# EAGLE design merch-hat (EAGLE 8.0.1)
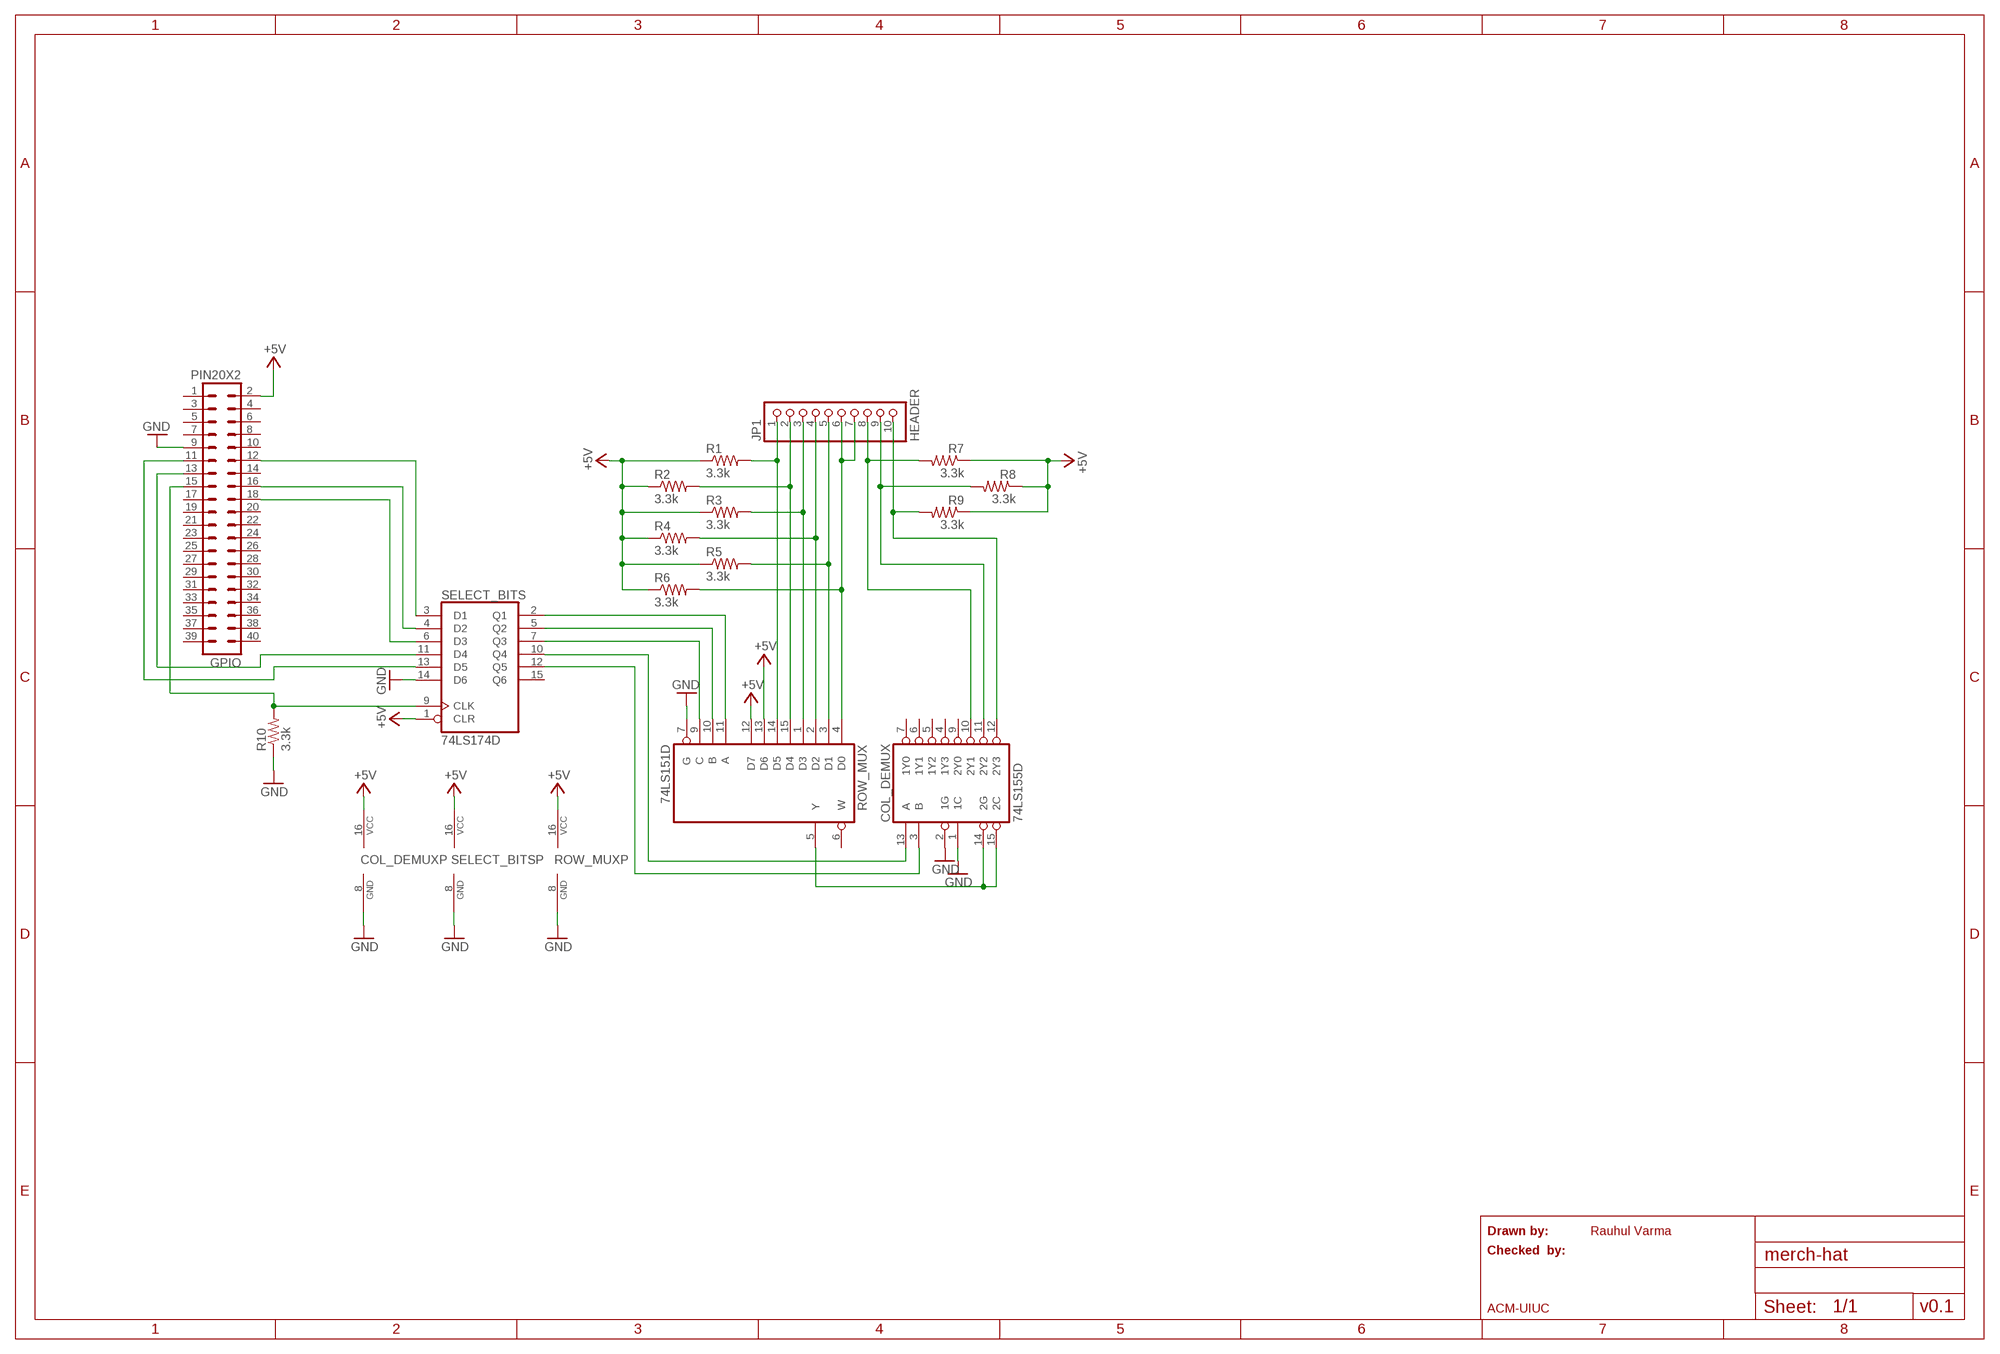
[diagram p0: schematic, sheet 1]

## Parts
COL_DEMUX  74LS155D  [SO16]
GPIO  PIN20X2  [PIN_20X2]
JP1  HEADER  PINHD-1X10  [1X10]
R1  3.3k  R-US_R0805  [R0805]
R2  3.3k  R-US_R0805  [R0805]
R3  3.3k  R-US_R0805  [R0805]
R4  3.3k  R-US_R0805  [R0805]
R5  3.3k  R-US_R0805  [R0805]
R6  3.3k  R-US_R0805  [R0805]
R7  3.3k  R-US_R0805  [R0805]
R8  3.3k  R-US_R0805  [R0805]
R9  3.3k  R-US_R0805  [R0805]
R10  3.3k  R-US_R0805  [R0805]
ROW_MUX  74LS151D  [SO16]
SELECT_BITS  74LS174D  [SO16]

## Nets
+5V: COL_DEMUX.16(VCC) GPIO.2 R1.1 R2.1 R3.1 R4.1 R5.1 R6.1 R7.1 R8.1 R9.1 ROW_MUX.12(D7) ROW_MUX.13(D6) ROW_MUX.16(VCC) SELECT_BITS.1(CLR) SELECT_BITS.16(VCC)
GND: COL_DEMUX.1(1C) COL_DEMUX.2(1G) COL_DEMUX.8(GND) GPIO.9 R10.1 ROW_MUX.7(G) ROW_MUX.8(GND) SELECT_BITS.8(GND) SELECT_BITS.14(D6)
N$1: JP1.1 R1.2 ROW_MUX.14(D5)
N$2: GPIO.16 SELECT_BITS.4(D2)
N$3: GPIO.18 SELECT_BITS.6(D3)
N$4: JP1.2 R2.2 ROW_MUX.15(D4)
N$5: GPIO.13 SELECT_BITS.11(D4)
N$6: GPIO.12 SELECT_BITS.3(D1)
N$7: GPIO.11 SELECT_BITS.13(D5)
N$8: GPIO.15 R10.2 SELECT_BITS.9(CLK)
N$9: JP1.3 R3.2 ROW_MUX.1(D3)
N$10: JP1.4 R4.2 ROW_MUX.2(D2)
N$11: JP1.5 R5.2 ROW_MUX.3(D1)
N$12: ROW_MUX.11(A) SELECT_BITS.2(Q1)
N$13: JP1.6 JP1.7 R6.2 ROW_MUX.4(D0)
N$14: COL_DEMUX.10(2Y1) JP1.8 R7.2
N$15: COL_DEMUX.11(2Y2) JP1.9 R8.2
N$16: COL_DEMUX.12(2Y3) JP1.10 R9.2
N$17: ROW_MUX.10(B) SELECT_BITS.5(Q2)
N$18: ROW_MUX.9(C) SELECT_BITS.7(Q3)
N$20: COL_DEMUX.13(A) SELECT_BITS.10(Q4)
N$21: COL_DEMUX.3(B) SELECT_BITS.12(Q5)
N$22: COL_DEMUX.14(2G) COL_DEMUX.15(2C) ROW_MUX.5(Y)
Unconnected: COL_DEMUX.4(1Y3) COL_DEMUX.5(1Y2) COL_DEMUX.6(1Y1) COL_DEMUX.7(1Y0) COL_DEMUX.9(2Y0) GPIO.1 GPIO.3 GPIO.4 GPIO.5 GPIO.6 GPIO.7 GPIO.8 GPIO.10 GPIO.14 GPIO.17 GPIO.19 GPIO.20 GPIO.21 GPIO.22 GPIO.23 GPIO.24 GPIO.25 GPIO.26 GPIO.27 GPIO.28 GPIO.29 GPIO.30 GPIO.31 GPIO.32 GPIO.33 GPIO.34 GPIO.35 GPIO.36 GPIO.37 GPIO.38 GPIO.39 GPIO.40 ROW_MUX.6(W) SELECT_BITS.15(Q6)

## Notes on the sheet
- Drawn by: | Rauhul Varma
- Checked  by:
- ACM-UIUC | v0.1

## Library data of the parts
COL_DEMUX = 74xx-us:74*155: Dual 2-line to 4-line data DECODER/DEMULTIPLEXER
GPIO = FLYFISH:PIN20X2
JP1 = pinhead:PINHD-1X10: PIN HEADER
R1-R10 = resistor:R-US_: RESISTOR, American symbol
ROW_MUX = 74xx-us:74*151: Data SELECTOR/MULTIPLEXER
SELECT_BITS = 74xx-us:74*174: Hex D type FLIP FLOP, clear

## Board
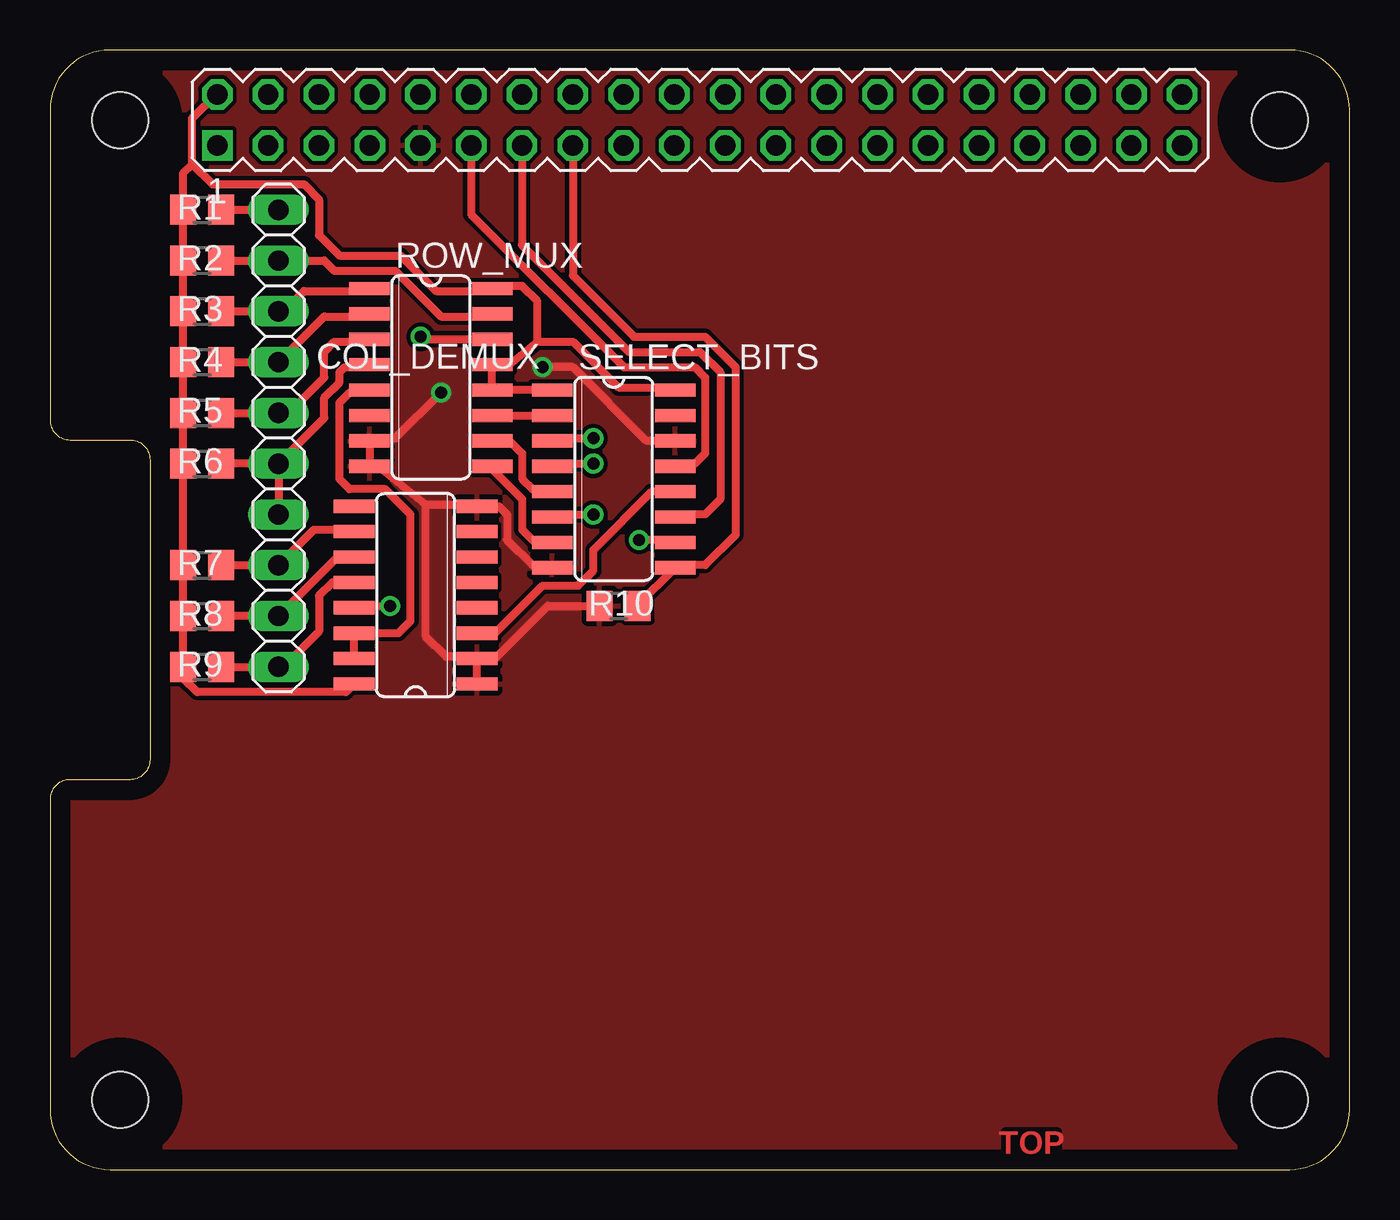
[diagram p1: board, top side]
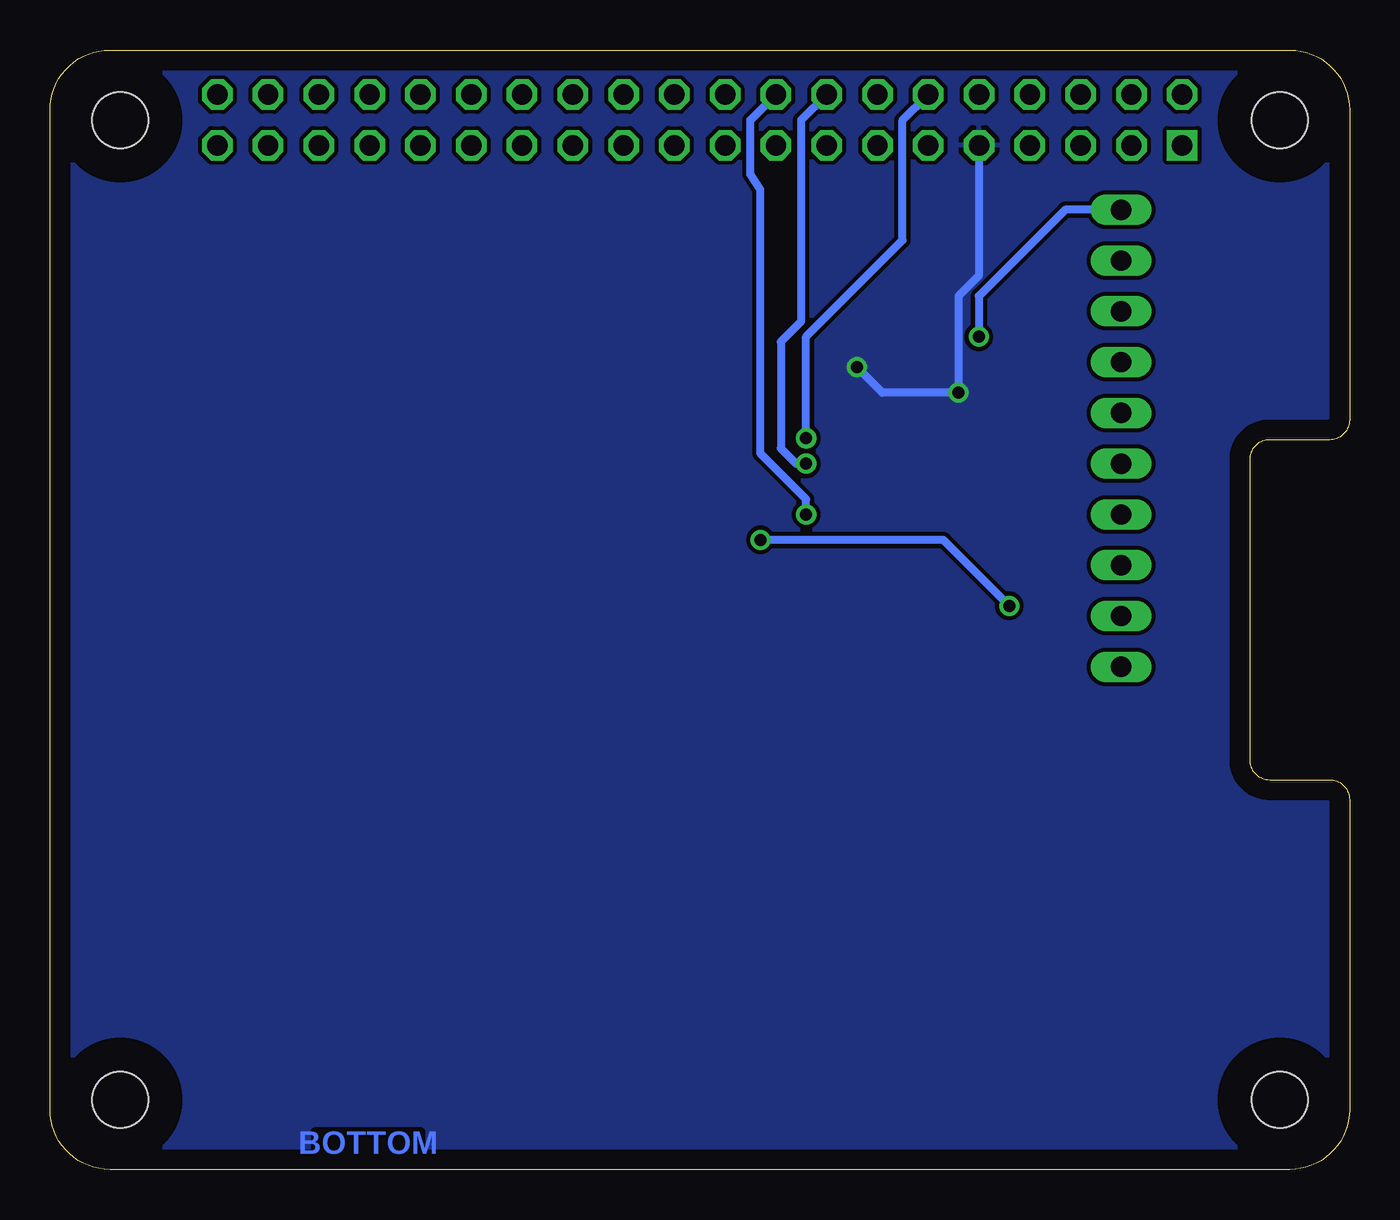
[diagram p2: board, bottom side, seen from below]

Size 65 x 56 mm. Coordinates in mm from the lower left corner, seen from the top.
Outline: 0,3 arc90 3,0 62,0 arc90 65,3 65,53 arc90 62,56 3,56 arc90 0,53 0,37.5 arc90 1,36.5 4,36.5 arc-90 5,35.5 5,20.5 arc-90 4,19.5 1,19.5 arc90 0,18.5 0,3
Copper layers (1*16): Top 0.035mm / dielectric 1.5mm / Bottom 0.035mm
Design rules "PCBway": minimum track width 6mil, minimum drill 0.3mm, track to track 0.205mm, track to pad 0.205mm, pad to pad 0.205mm, via to via 0.205mm, smd to smd 8mil, copper to edge 40mil, drill to drill 8mil, minimum pad ring 10mil, minimum via ring 8mil, stop-mask expansion 4mil, vias tented up to drill 25mil, thermal gap 10mil
Holes 2.8 mm at 3.5,3.5 3.5,52.5 61.5,52.5 61.5,3.5
tRestrict: area 1.9,51 to 5,54; area 60,51 to 63,54; area 60,1.9 to 63,5; area 1.9,1.9 to 5,5
bRestrict: area 1.9,1.9 to 5,5; area 1.9,51 to 5,54; area 60,1.9 to 63,5; area 60,51 to 63,54

### Footprints (pad centres in the part's own frame; a part is rotated, then mirrored left to right if it is on the bottom)
SO16 = smd 0.66 x 2.032: 1 -4.445,-3.073; 2 -3.175,-3.073; 3 -1.905,-3.073; 4 -0.635,-3.073; 5 0.635,-3.073; 6 1.905,-3.073; 7 3.175,-3.073; 8 4.445,-3.073; 9 4.445,3.073; 10 3.175,3.073; 11 1.905,3.073; 12 0.635,3.073; 13 -0.635,3.073; 14 -1.905,3.073; 15 -3.175,3.073; 16 -4.445,3.073
PIN_20X2 = drill 1.016 square: 1 -24.13,-1.27 | drill 1.016 octagon: 2 -24.13,1.27; 3 -21.59,-1.27; 4 -21.59,1.27; 5 -19.05,-1.27; 6 -19.05,1.27; 7 -16.51,-1.27; 8 -16.51,1.27; 9 -13.97,-1.27; 10 -13.97,1.27; 11 -11.43,-1.27; 12 -11.43,1.27; 13 -8.89,-1.27; 14 -8.89,1.27; 15 -6.35,-1.27; 16 -6.35,1.27; 17 -3.81,-1.27; 18 -3.81,1.27; 19 -1.27,-1.27; 20 -1.27,1.27; 21 1.27,-1.27; 22 1.27,1.27; 23 3.81,-1.27; 24 3.81,1.27; 25 6.35,-1.27; 26 6.35,1.27; 27 8.89,-1.27; 28 8.89,1.27; 29 11.43,-1.27; 30 11.43,1.27; 31 13.97,-1.27; 32 13.97,1.27; 33 16.51,-1.27; 34 16.51,1.27; 35 19.05,-1.27; 36 19.05,1.27; 37 21.59,-1.27; 38 21.59,1.27; 39 24.13,-1.27; 40 24.13,1.27
1X10 = drill 1.016 long: 1 -11.43,0; 2 -8.89,0; 3 -6.35,0; 4 -3.81,0; 5 -1.27,0; 6 1.27,0; 7 3.81,0; 8 6.35,0; 9 8.89,0; 10 11.43,0
R0805 = smd 1.3 x 1.5: 1 -0.95,0; 2 0.95,0

### Placement (x,y rotation side)
COL_DEMUX  18.29,28.73 90 top
GPIO  32.5,52.5 0 top
JP1  11.43,36.58 270 top
R1  7.62,48.01 0 top
R2  7.62,45.47 0 top
R3  7.62,42.93 0 top
R4  7.62,40.39 0 top
R5  7.62,37.85 0 top
R6  7.62,35.31 0 top
R7  7.62,30.23 0 top
R8  7.62,27.69 0 top
R9  7.62,25.15 0 top
R10  28.45,28.19 0 top
ROW_MUX  19.05,39.62 270 top
SELECT_BITS  28.19,34.54 270 top

### Tracks (layer width: path | path; a pad name or v marks a point on that pad's centre or on a via)
+5V
  Top 0.406: GPIO.2 8.3,53.77 7.11,52.58 7.11,50.29 | COL_DEMUX.16 14.8,23.88 7.37,23.88 6.67,24.57 R9.1 R8.1 R7.1 R6.1 R5.1 R4.1 R3.1 R2.1 R1.1 6.67,49.85 7.11,50.29 | 24.38,41.4 22.99,40.26 ROW_MUX.13 ROW_MUX.12 SELECT_BITS.1 | 24.38,41.4 24.38,43.43 23.62,44.2 22.25,44.2 ROW_MUX.16 | 7.11,50.29 8.13,49.28 12.7,49.28 13.46,48.51 13.46,46.74 14.48,45.72 17.53,45.72 19.3,43.94 22,43.94 ROW_MUX.16 | ROW_MUX.16 22,44.2 | 24.38,41.4 26.16,41.4 28.45,39.12 31.14,39.12 SELECT_BITS.16
GND  (via drill 0.6)
  Top 0.406: 18.8,33.27 16.38,35.18 ROW_MUX.8 ROW_MUX.7 16.1,36.58 17.27,36.58 v19.56,38.86 | 18.8,33.27 21.2,33.27 COL_DEMUX.8 22.45,33.18 22.86,32.77 22.86,31.5 24.13,30.23 24.99,30.23 SELECT_BITS.8 | 21.26,24.38 COL_DEMUX.1 COL_DEMUX.2 | COL_DEMUX.2 21.26,25.65 19.81,25.65 18.8,26.67 18.8,33.27 | 31.14,36.58 SELECT_BITS.14 29.84,36.45 26.16,40.13 v24.64,40.13 | COL_DEMUX.2 22.25,25.56 24.89,28.19 R10.1
  Bottom 0.406: 18.54,51.22 GPIO.9 18.54,51.22 | v24.64,40.13 23.37,38.86 v19.56,38.86 19.56,43.69 18.54,44.7 18.54,51.22
  pour Bottom: 0,3 arc90 3,0 62,0 arc90 65,3 65,53 arc90 62,56 3,56 arc90 0,53 0,37.5 arc90 1,36.5 4,36.5 arc-90 5,35.5 5,20.5 arc-90 4,19.5 1,19.5 arc90 0,18.5
  pour Top: 0,3 arc90 3,0 62,0 arc90 65,3 65,53 arc90 62,56 3,56 arc90 0,53 0,37.5 arc90 1,36.5 4,36.5 arc-90 5,35.5 5,20.5 arc-90 4,19.5 1,19.5 arc90 0,18.5
N$1  (via drill 0.6)
  Top 0.406: 22.25,41.4 ROW_MUX.14 18.67,41.53 v18.54,41.66 | R1.2 JP1.1
  Bottom 0.406: JP1.1 14.22,48.01 18.54,43.69 v18.54,41.66
N$2  (via drill 0.6)
  Top 0.406: SELECT_BITS.4 25.25,35.31 v27.18,35.31
  Bottom 0.406: v27.18,35.31 27.69,35.31 28.45,36.07 28.45,41.4 27.43,42.42 27.43,52.49 GPIO.16
N$3  (via drill 0.6)
  Top 0.406: SELECT_BITS.6 25.25,32.77 v27.18,32.77
  Bottom 0.406: v27.18,32.77 27.18,33.53 29.46,35.81 29.46,49.02 29.97,49.78 29.97,52.49 GPIO.18
N$4
  Top 0.406: ROW_MUX.15 22,42.67 19.56,42.67 17.27,44.96 14.22,44.96 13.72,45.47 JP1.2 R2.2
N$5
  Top 0.406: GPIO.13 23.61,46.24 28.96,40.89 32.51,40.89 33.53,39.88 33.53,33.53 32.77,32.77 31.39,32.77 SELECT_BITS.11
N$6  (via drill 0.6)
  Top 0.406: SELECT_BITS.3 25.25,36.58 v27.18,36.58
  Bottom 0.406: v27.18,36.58 27.18,41.66 22.35,46.48 22.35,52.49 GPIO.12
N$7
  Top 0.406: GPIO.11 21.07,47.76 28.7,40.13 32.26,40.13 32.77,39.62 32.77,35.81 32.26,35.31 31.39,35.31 SELECT_BITS.13
N$8
  Top 0.406: GPIO.15 26.15,44.72 29.21,41.66 32.77,41.66 34.29,40.13 34.29,31.75 32.77,30.23 31.39,30.23 SELECT_BITS.9 29.4,28.23 R10.2
N$9
  Top 0.406: R3.2 JP1.3 11.68,42.93 12.7,43.94 15.85,43.94 ROW_MUX.1
N$10
  Top 0.406: R4.2 JP1.4 13.72,42.67 15.85,42.67 ROW_MUX.2
N$11
  Top 0.406: R5.2 JP1.5 11.94,37.85 13.72,39.62 13.72,40.89 14.22,41.4 15.85,41.4 ROW_MUX.3
N$12
  Top 0.406: ROW_MUX.11 SELECT_BITS.2
N$13
  Top 0.406: JP1.6 R6.2 | JP1.6 JP1.7 | JP1.6 13.72,37.59 13.72,38.61 14.48,39.37 14.48,39.88 14.73,40.13 15.85,40.13 ROW_MUX.4
N$14
  Top 0.406: R7.2 JP1.8 13.21,32 15.12,32 COL_DEMUX.10
N$15
  Top 0.406: R8.2 JP1.9 14.38,30.64 COL_DEMUX.11
N$16
  Top 0.406: R9.2 JP1.10 11.68,25.15 13.46,26.92 13.46,28.7 14.13,29.37 COL_DEMUX.12
N$17
  Top 0.406: ROW_MUX.10 22.99,36.45 23.62,35.81 23.62,34.54 24.13,34.04 24.99,34.04 SELECT_BITS.5
N$18
  Top 0.406: ROW_MUX.9 22.12,35.03 23.62,33.53 23.62,32 24.38,31.24 24.99,31.24 SELECT_BITS.7
N$20  (via drill 0.6)
  Top 0.406: COL_DEMUX.13 15.31,28.19 v17.02,28.19 | SELECT_BITS.10 31.14,31.5 v29.46,31.5
  Bottom 0.406: v17.02,28.19 20.32,31.5 v29.46,31.5
N$21
  Top 0.406: SELECT_BITS.12 30.1,33.91 27.18,30.99 27.18,29.97 26.42,29.21 24.64,29.21 22.25,26.83 COL_DEMUX.3
N$22
  Top 0.406: COL_DEMUX.15 COL_DEMUX.14 17.43,26.83 18.03,27.43 18.03,32.77 16.76,34.04 14.99,34.04 14.48,34.54 14.48,38.35 14.99,38.86 15.85,38.86 ROW_MUX.5

### Text on the board
Top: TOP
Bottom: BOTTOM